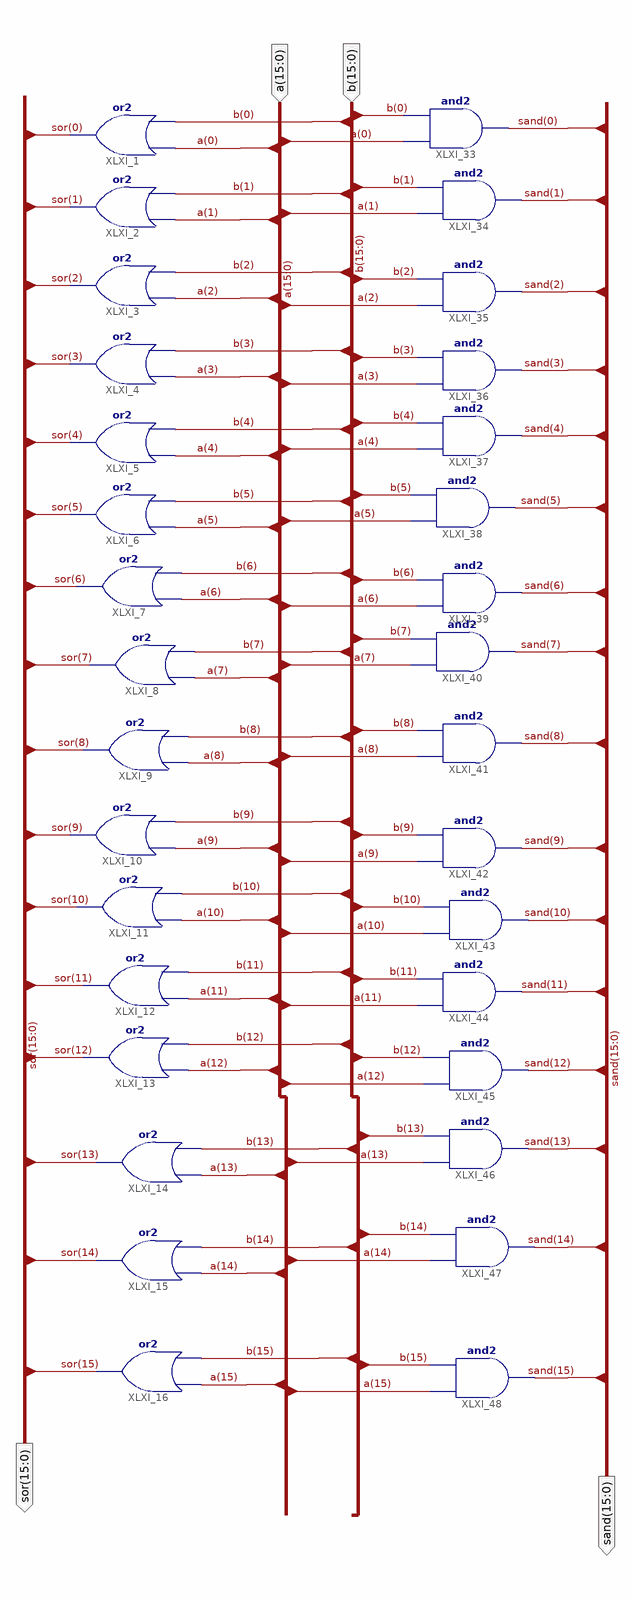
[diagram p0: schematic sheet 1]
// Xilinx ISE schematic andor.sch (spartan3e) as structural Verilog: 32 symbols, 4 ports
module andor (
  input  [15:0] a,
  input  [15:0] b,
  output [15:0] sor,
  output [15:0] sand
);

  or XLXI_1 (sor[0], b[0], a[0]);
  or XLXI_2 (sor[1], b[1], a[1]);
  or XLXI_3 (sor[2], b[2], a[2]);
  or XLXI_4 (sor[3], b[3], a[3]);
  or XLXI_5 (sor[4], b[4], a[4]);
  or XLXI_6 (sor[5], b[5], a[5]);
  or XLXI_7 (sor[6], b[6], a[6]);
  or XLXI_8 (sor[7], b[7], a[7]);
  or XLXI_9 (sor[8], b[8], a[8]);
  or XLXI_10 (sor[9], b[9], a[9]);
  or XLXI_11 (sor[10], b[10], a[10]);
  or XLXI_12 (sor[11], b[11], a[11]);
  or XLXI_13 (sor[12], b[12], a[12]);
  or XLXI_14 (sor[13], b[13], a[13]);
  or XLXI_15 (sor[14], b[14], a[14]);
  or XLXI_16 (sor[15], b[15], a[15]);
  and XLXI_33 (sand[0], a[0], b[0]);
  and XLXI_34 (sand[1], a[1], b[1]);
  and XLXI_35 (sand[2], a[2], b[2]);
  and XLXI_36 (sand[3], a[3], b[3]);
  and XLXI_37 (sand[4], a[4], b[4]);
  and XLXI_38 (sand[5], a[5], b[5]);
  and XLXI_39 (sand[6], a[6], b[6]);
  and XLXI_40 (sand[7], a[7], b[7]);
  and XLXI_41 (sand[8], a[8], b[8]);
  and XLXI_42 (sand[9], a[9], b[9]);
  and XLXI_43 (sand[10], a[10], b[10]);
  and XLXI_44 (sand[11], a[11], b[11]);
  and XLXI_45 (sand[12], a[12], b[12]);
  and XLXI_46 (sand[13], a[13], b[13]);
  and XLXI_47 (sand[14], a[14], b[14]);
  and XLXI_48 (sand[15], a[15], b[15]);
endmodule
